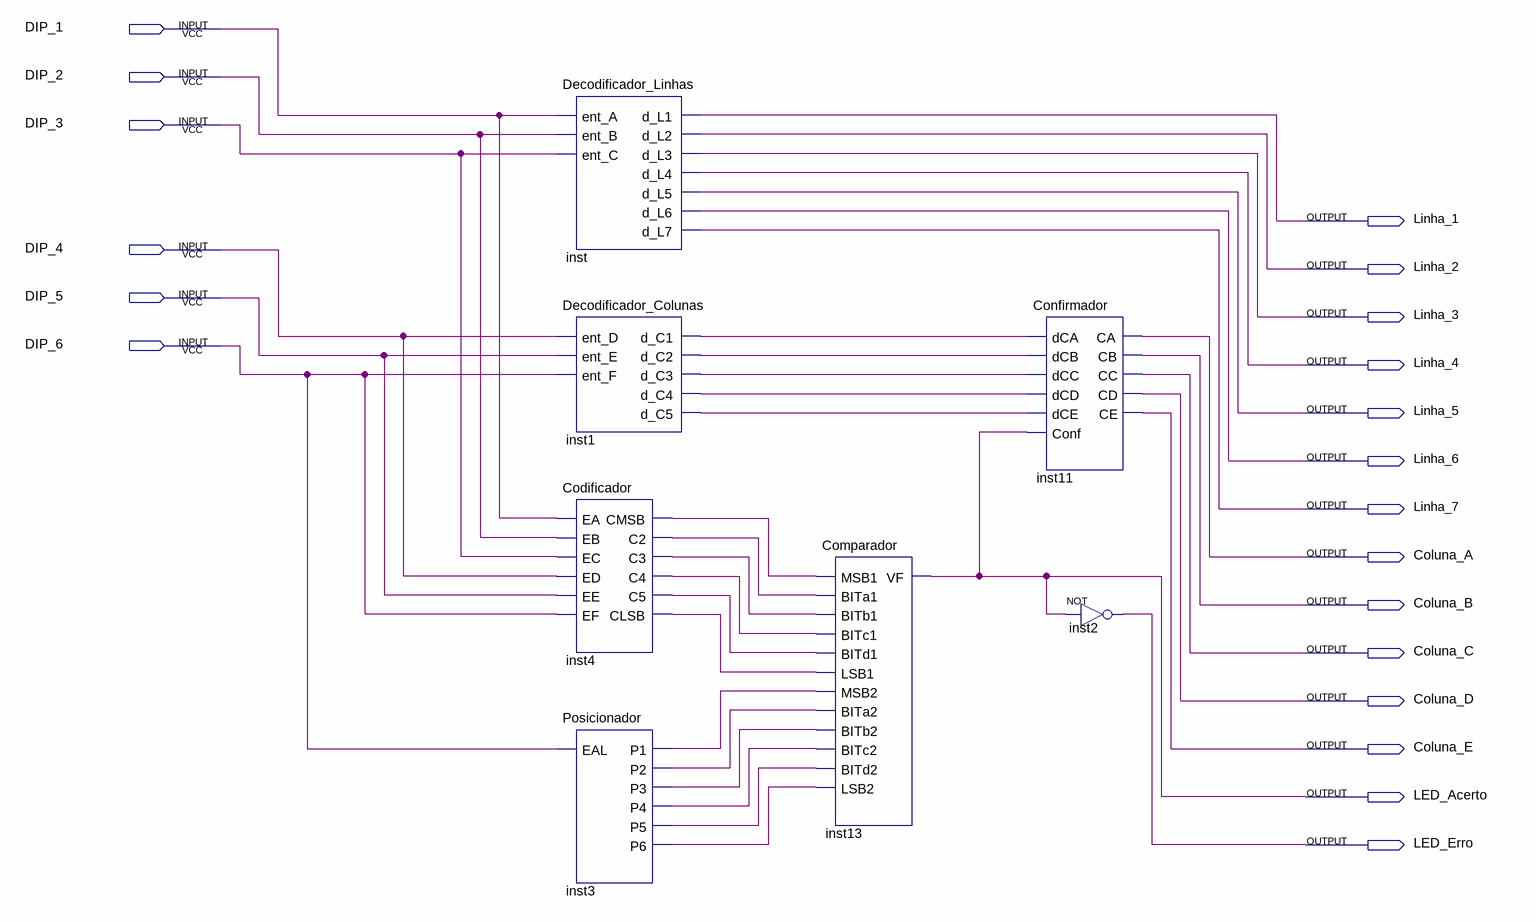
[diagram p0: schematic sheet]
// Quartus schematic Batalha_Naval_Digital.bdf as structural Verilog: 7 symbols, 20 pins
module Batalha_Naval_Digital (
  input  DIP_1,
  input  DIP_2,
  input  DIP_3,
  input  DIP_4,
  input  DIP_5,
  input  DIP_6,
  output Linha_1,
  output Linha_2,
  output Linha_3,
  output Linha_4,
  output Linha_5,
  output Linha_6,
  output Linha_7,
  output Coluna_A,
  output Coluna_B,
  output Coluna_C,
  output Coluna_D,
  output Coluna_E,
  output LED_Acerto,
  output LED_Erro
);

  wire inst1_d_c1, inst1_d_c2, inst1_d_c3, inst1_d_c4, inst1_d_c5, inst3_p1, inst3_p2, inst3_p3, inst3_p4,
       inst3_p5, inst3_p6, inst4_c2, inst4_c3, inst4_c4, inst4_c5, inst4_clsb, inst4_cmsb;

  Decodificador_Linhas inst (
    .ent_A(DIP_1), .ent_B(DIP_2), .ent_C(DIP_3), .d_L1(Linha_1), .d_L2(Linha_2), .d_L3(Linha_3),
    .d_L4(Linha_4), .d_L5(Linha_5), .d_L6(Linha_6), .d_L7(Linha_7));
  Decodificador_Colunas inst1 (
    .ent_D(DIP_4), .ent_E(DIP_5), .ent_F(DIP_6), .d_C1(inst1_d_c1), .d_C2(inst1_d_c2), .d_C3(inst1_d_c3),
    .d_C4(inst1_d_c4), .d_C5(inst1_d_c5));
  Codificador inst4 (
    .EA(DIP_1), .EB(DIP_2), .EC(DIP_3), .ED(DIP_4), .EE(DIP_5), .EF(DIP_6), .CMSB(inst4_cmsb), .C2(inst4_c2),
    .C3(inst4_c3), .C4(inst4_c4), .C5(inst4_c5), .CLSB(inst4_clsb));
  Posicionador inst3 (
    .EAL(DIP_6), .P1(inst3_p1), .P2(inst3_p2), .P3(inst3_p3), .P4(inst3_p4), .P5(inst3_p5), .P6(inst3_p6));
  Comparador inst13 (
    .MSB1(inst4_cmsb), .BITa1(inst4_c2), .BITb1(inst4_c3), .BITc1(inst4_c4), .BITd1(inst4_c5),
    .LSB1(inst4_clsb), .MSB2(inst3_p1), .BITa2(inst3_p2), .BITb2(inst3_p3), .BITc2(inst3_p4),
    .BITd2(inst3_p5), .LSB2(inst3_p6), .VF(LED_Acerto));
  Confirmador inst11 (
    .dCA(inst1_d_c1), .dCB(inst1_d_c2), .dCC(inst1_d_c3), .dCD(inst1_d_c4), .dCE(inst1_d_c5),
    .Conf(LED_Acerto), .CA(Coluna_A), .CB(Coluna_B), .CC(Coluna_C), .CD(Coluna_D), .CE(Coluna_E));
  not inst2 (LED_Erro, LED_Acerto);
endmodule
